# EAGLE schematic RatDBS-Compact2032Battery (EAGLE 7.3.0)
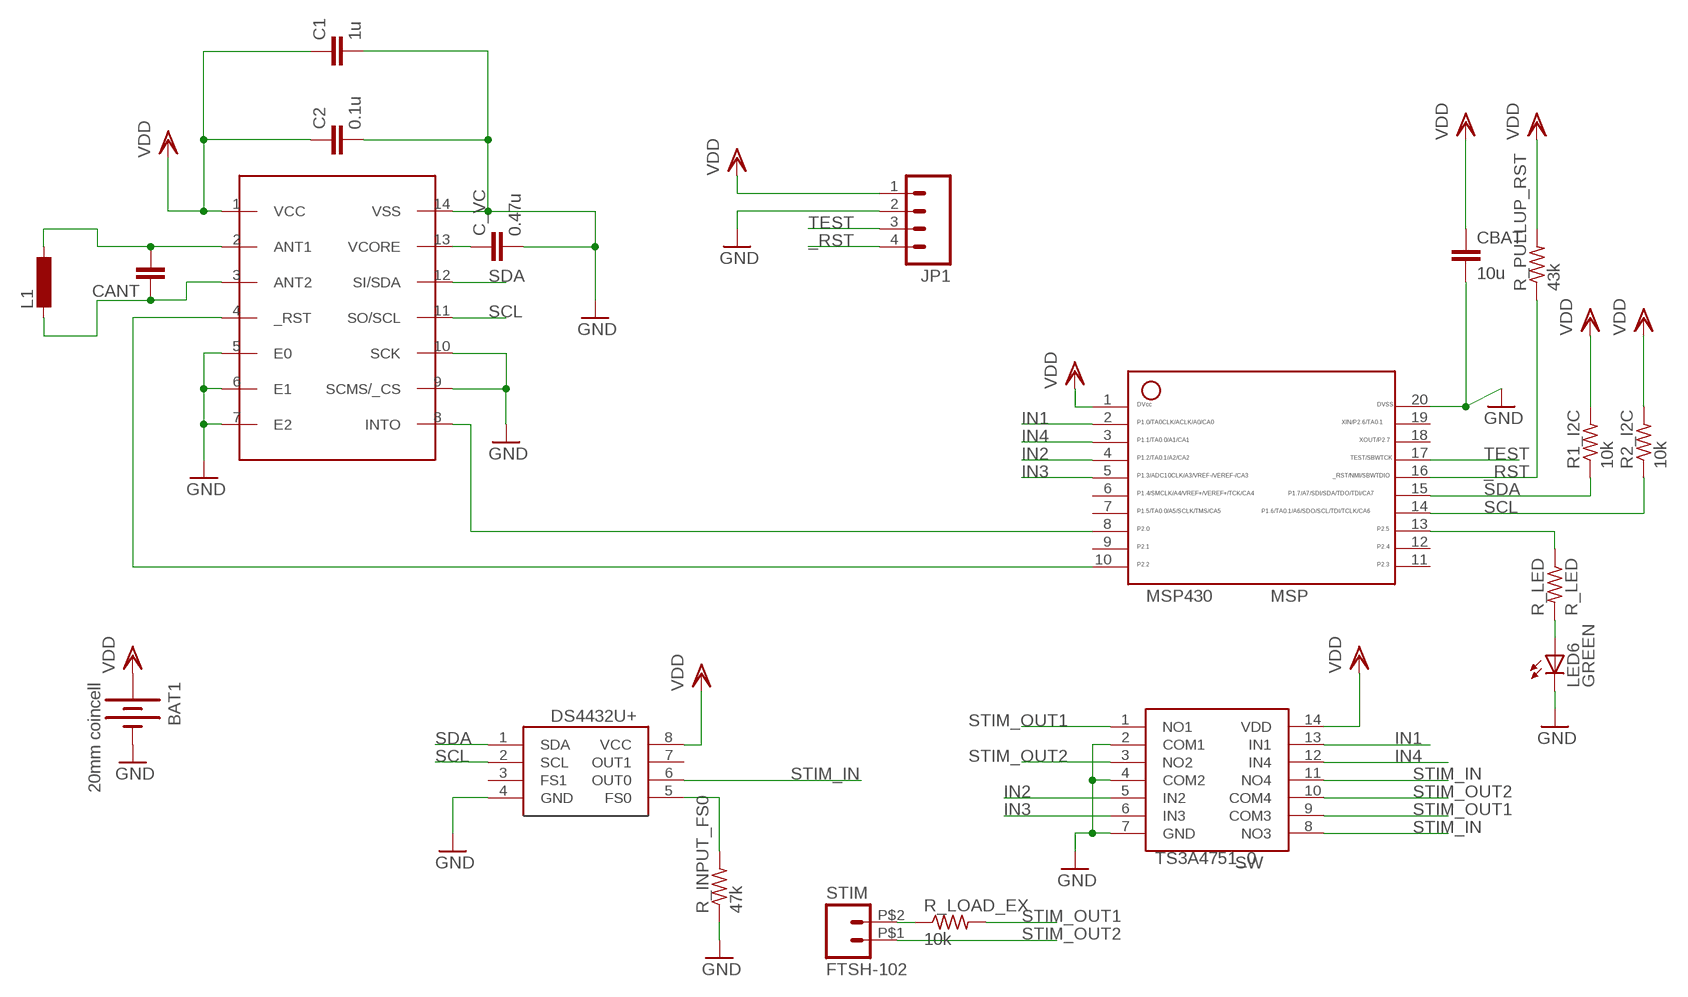
[diagram p0: schematic, sheet 1]

## Parts
BAT1  20mm coincell  BATTERYFOB  [BATTCON_20MM_PTH_COMPACT]
C1  1u  C-EUC0603  [C0603]
C2  0.1u  C-EUC0603  [C0603]
C_VC  0.47u  C-EUC0603  [C0603]
CANT  C-EUC0603  [C0603]
CBAT  10u  C-EUC0603  [C0603]
DS4432U+  DS4432U+  [8_PIN]
JP1  M041.27MM  [1X04-1.27MM]
L1  L-EUWE-TPC  [POWER-CHOKE_WE-TPC]
LED6  GREEN  LED1206  [LED-1206]
MSP430  MSP  MSP430  [20_PIN]
R1_I2C  10k  R-US_R0603  [R0603]
R2_I2C  10k  R-US_R0603  [R0603]
R_INPUT_FS0  47k  R-US_R0603  [R0603]
R_LED  R_LED  R-US_R0603  [R0603]
R_LOAD_EX  10k  R-US_R0603  [R0603]
R_PULLUP_RST  43k  R-US_R0603  [R0603]
STIM  FTSH-102  [FTSH-102-DH]
TS3A4751_0  SW  TS3A4751  [14_PIN]
U$1  RF  RF430CL330H  [PW_R-PDSO-G14]

## Nets
_RST: JP1.4 MSP430.16 R_PULLUP_RST.1
GND: BAT1.2(-) C1.2 C2.2 C_VC.2 CBAT.2 DS4432U+.4(GND) JP1.2 LED6.C MSP430.20 R_INPUT_FS0.1 TS3A4751_0.2(COM1) TS3A4751_0.4(COM2) TS3A4751_0.7(GND) U$1.5(E0) U$1.6(E1) U$1.7(E2) U$1.9(SCMS/_CS) U$1.10(SCK) U$1.14(VSS)
IN1: MSP430.2 TS3A4751_0.13(IN1)
IN2: MSP430.4 TS3A4751_0.5(IN2)
IN3: MSP430.5 TS3A4751_0.6(IN3)
IN4: MSP430.3 TS3A4751_0.12(IN4)
N$1: C_VC.1 U$1.13(VCORE)
N$2: CANT.2 L1.1 U$1.2(ANT1)
N$3: MSP430.8 U$1.8(INTO)
N$4: R_LOAD_EX.1 STIM.P$2
N$5: MSP430.13 R_LED.1
N$6: MSP430.7
N$7: MSP430.10 U$1.4(_RST)
N$8: DS4432U+.5(FS0) R_INPUT_FS0.2
N$9: LED6.A R_LED.2
N$12: CANT.1 L1.2 U$1.3(ANT2)
SCL: DS4432U+.2(SCL) MSP430.14 R2_I2C.1 U$1.11(SO/SCL)
SDA: DS4432U+.1(SDA) MSP430.15 R1_I2C.1 U$1.12(SI/SDA)
STIM_IN: DS4432U+.6(OUT0) TS3A4751_0.8(NO3) TS3A4751_0.11(NO4)
STIM_OUT1: R_LOAD_EX.2 TS3A4751_0.1(NO1) TS3A4751_0.9(COM3)
STIM_OUT2: STIM.P$1 TS3A4751_0.3(NO2) TS3A4751_0.10(COM4)
TEST: JP1.3 MSP430.17
VDD: BAT1.1(+) BAT1.3(+) BAT1.4(+) BAT1.5(+) C1.1 C2.1 CBAT.1 DS4432U+.8(VCC) JP1.1 MSP430.1 R1_I2C.2 R2_I2C.2 R_PULLUP_RST.2 TS3A4751_0.14(VDD) U$1.1(VCC)
Unconnected: DS4432U+.3(FS1) DS4432U+.7(OUT1) MSP430.6 MSP430.9 MSP430.11 MSP430.12 MSP430.18 MSP430.19

## Library data of the parts
BAT1 = Battery:BATTERY: Compact CR2032 Battery Holder SMT ground pad 20MM_4LEGS, Digikey: BAT-HLD-001-THM-OTL
C1 C2 C_VC CANT CBAT = rcl:C-EU: CAPACITOR, European symbol
DS4432U+ = RatDBS:DS4432U+: DS4432U+ current DAC
JP1 = SparkFun:M04: Header 4 Standard 4-pin 0.1" header. Use with straight break away headers (SKU : PRT-00116), right angle break away headers (PRT-00553), swiss pins (PRT-00743), machine pins (PRT-00117), and female headers (PRT-00115). Molex polarized connector foot print use with SKU : PRT-08231 with associated crimp pins and housings.
L1 = rcl:L-EU: INDUCTOR, European symbol
LED6 = SparkFun-LED:LED: LEDs Standard schematic elements and footprints for 5mm, 3mm, 1206, and 0603 sized LEDs. 5mm - Spark Fun Electronics SKU : COM-00529 (and others)
MSP430 = RatDBS:MSP430: MSP430 20 pins
R1_I2C R2_I2C R_INPUT_FS0 R_LED R_LOAD_EX R_PULLUP_RST = BiphasicBoard:R-US_: RESISTOR, American symbol
STIM = Samtec50Mil:FTSH-102
TS3A4751_0 = BiphasicBoard:TS3A4751: TS3A4751 Quad Switch
U$1 = RF430CL330H:RF430CL330H